# Altium schematic sheet FMC.SchDoc: FMC 5GS/s ADC/TDC
size 420 x 297 mm; Author: Agnieszka Bartkowicz; CompanyName: WUT ISE; DrawnBy: Agnieszka Bartkowicz; Engineer: Agnieszka Bartkowicz; Organization: WUT ISE; Address1: PW ISE; Address2: Nowowiejska 15/19 00-665 Warsaw; Address3: gyorka@o2.pl; SheetNumber: 11; SheetTotal: 13; ModifiedBy: -; CheckedDate: -; Title2: Title 2; DivGrp: WUT ISE; Designer: A. Bartkowicz
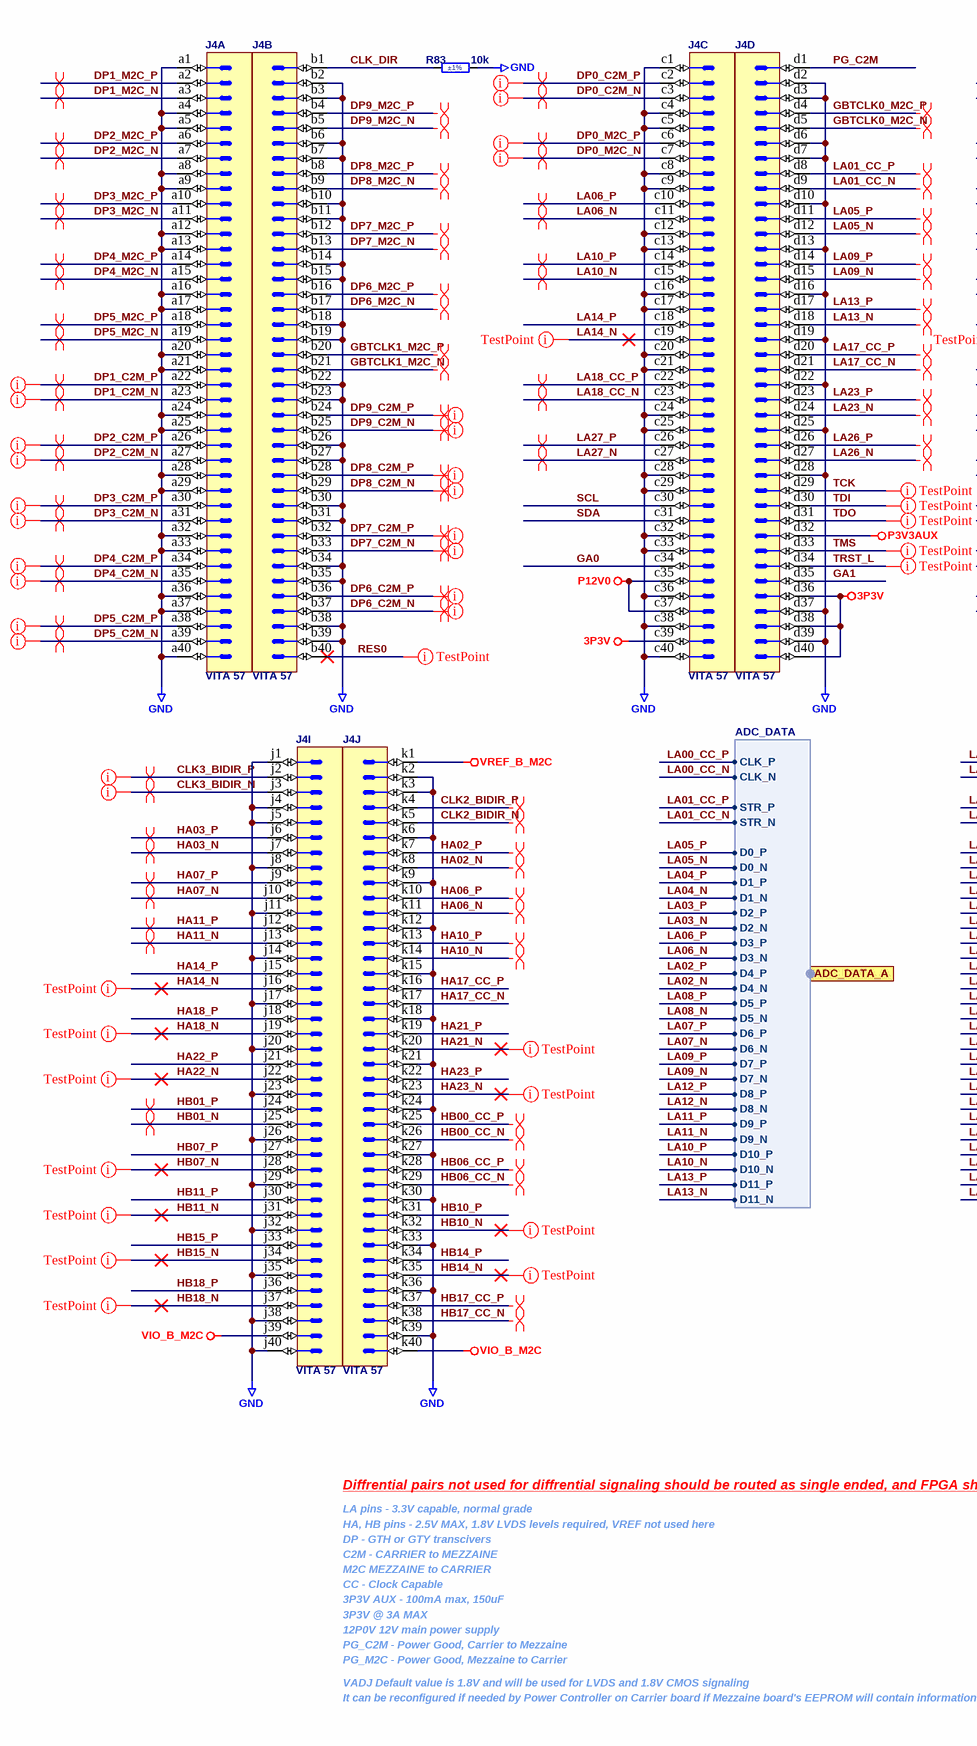
[diagram p0: FMC.SchDoc, left]
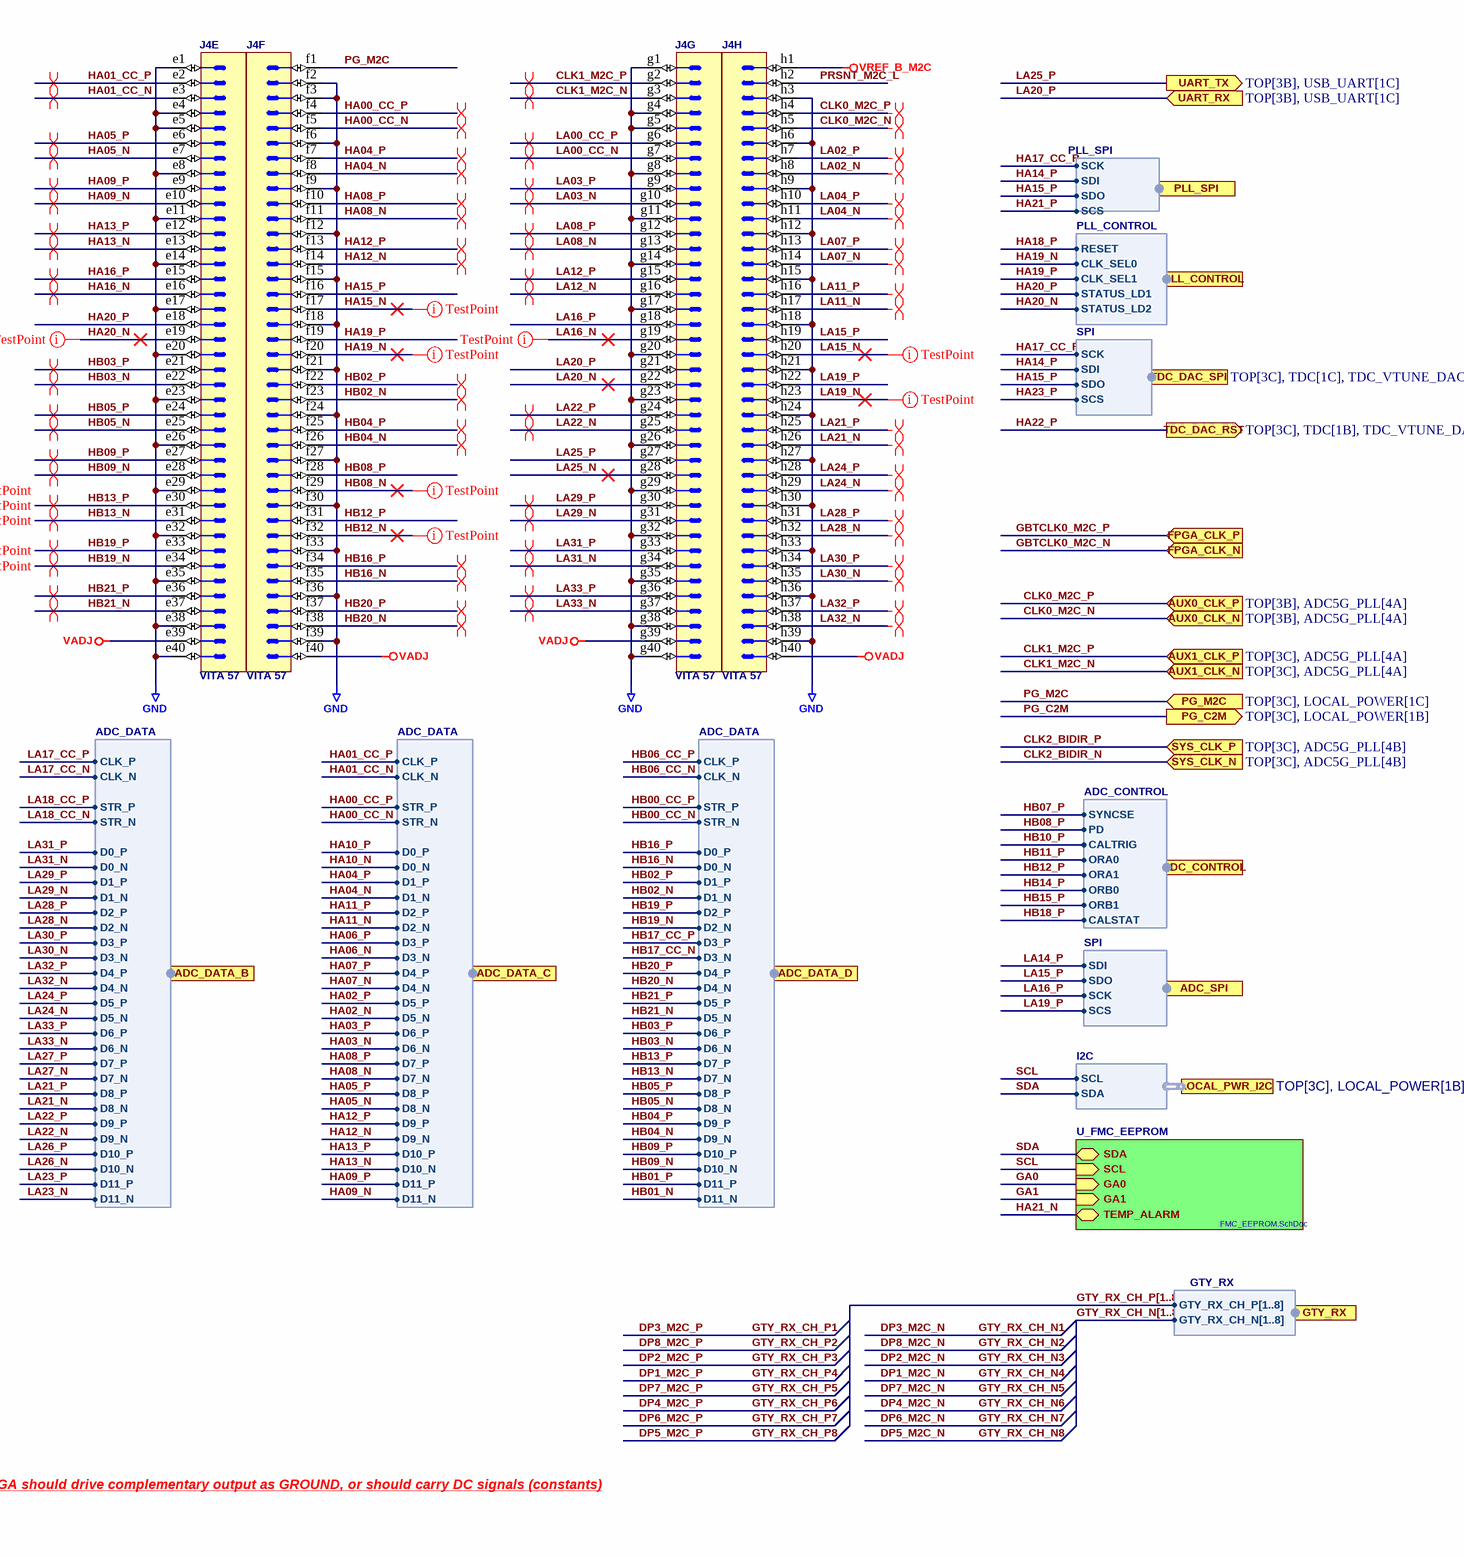
[diagram p1: FMC.SchDoc, right]

## Parts
J4  VITA 57  [SAMTEC_ASP-134488-01]  (parts A,B,C,D,E,F,G,H,I,J of 10)
R83  10k  Tolerance: ±1%  [RESC1005X40N]

## Sub-sheets
U_FMC_EEPROM = FMC_EEPROM.SchDoc: SDA (bidir), SCL (in), GA0 (in), GA1 (in), TEMP_ALARM (bidir)

## Ports
ADC_CONTROL (in, harness ADC_CONTROL, see TOP[3B], ADC5G[4B], ADC5G_FRONTEND[2C]), ADC_DATA_A (in, harness ADC_DATA, see TOP[3B], ADC5G[4B], ADC5G_DIGITALIO[3B]), ADC_DATA_B (in, harness ADC_DATA, see TOP[3B], ADC5G[4B], ADC5G_DIGITALIO[3D]), ADC_DATA_C (in, harness ADC_DATA, see TOP[3B], ADC5G[4B], ADC5G_DIGITALIO[4B]), ADC_DATA_D (in, harness ADC_DATA, see TOP[3B], ADC5G[4B], ADC5G_DIGITALIO[4D]), ADC_SPI (in, harness SPI, see TOP[3B], ADC5G[4B], ADC5G_FRONTEND[2C]), AUX0_CLK_N (in, see TOP[3B], ADC5G_PLL[4A]), AUX0_CLK_P (in, see TOP[3B], ADC5G_PLL[4A]), AUX1_CLK_N (in, see TOP[3C], ADC5G_PLL[4A]), AUX1_CLK_P (in, see TOP[3C], ADC5G_PLL[4A]), FPGA_CLK_N (in, see TOP[3B], ADC5G_PLL[4B]), FPGA_CLK_P (in, see TOP[3B], ADC5G_PLL[4B]), GTY_RX (in, harness GTY_RX, see TOP[3C], TDC[5A]), LOCAL_PWR_I2C (harness I2C, see TOP[3C], LOCAL_POWER[1B]), PG_C2M (out, see TOP[3C], LOCAL_POWER[1B]), PG_M2C (in, see TOP[3C], LOCAL_POWER[1C]), PLL_CONTROL (in, harness PLL_CONTROL, see TOP[3B], ADC5G_PLL[5D]), PLL_SPI (in, harness PLL_SPI, see TOP[3B], ADC5G_PLL[5C]), SYS_CLK_N (in, see TOP[3C], ADC5G_PLL[4B]), SYS_CLK_P (in, see TOP[3C], ADC5G_PLL[4B]), TDC_DAC_RST (out, see TOP[3C], TDC[1B], TDC_VTUNE_DAC[2B]), TDC_DAC_SPI (in, harness SPI, see TOP[3C], TDC[1C], TDC_VTUNE_DAC[2A]), UART_RX (in, see TOP[3B], USB_UART[1C]), UART_TX (out, see TOP[3B], USB_UART[1C])

## Harnesses
ADC_DATA: CLK_P, CLK_N, STR_P, STR_N, D0_P, D1_P, D2_P, D3_P, D4_P, D5_P, D6_P, D7_P, D8_P, D9_P, D10_P, D11_P, D11_N, D10_N, D9_N, D8_N, D7_N, D6_N, D5_N, D4_N, D3_N, D2_N, D1_N, D0_N
SPI: SDI, SDO, SCK, SCS
ADC_CONTROL: SYNCSE, PD, CALTRIG, ORA0, ORA1, ORB0, ORB1, CALSTAT
PLL_SPI: SCK, SDI, SDO, SCS
PLL_CONTROL: RESET, CLK_SEL0, CLK_SEL1, STATUS_LD1, STATUS_LD2
GTY_RX: GTY_RX_CH_P[1..8], GTY_RX_CH_N[1..8]
I2C: SCL, SDA

## Nets
3P3V: J4.c39 J4.d36 J4.d38 J4.d40
GND: J4.a1 J4.a4 J4.a5 J4.a8 J4.a9 J4.a12 J4.a13 J4.a16 J4.a17 J4.a20 J4.a21 J4.a24 J4.a25 J4.a28 J4.a29 J4.a32 J4.a33 J4.a36 J4.a37 J4.a40 J4.b2 J4.b3 J4.b6 J4.b7 J4.b10 J4.b11 J4.b14 J4.b15 J4.b18 J4.b19 J4.b22 J4.b23 J4.b26 J4.b27 J4.b30 J4.b31 J4.b34 J4.b35 J4.b38 J4.b39 J4.c1 J4.c4 J4.c5 J4.c8 J4.c9 J4.c12 J4.c13 J4.c16 J4.c17 J4.c20 J4.c21 J4.c24 J4.c25 J4.c28 J4.c29 J4.c32 J4.c33 J4.c36 J4.c38 J4.c40 J4.d2 J4.d3 J4.d6 J4.d7 J4.d10 J4.d13 J4.d16 J4.d19 J4.d22 J4.d25 J4.d28 J4.d37 J4.d39 J4.e1 J4.e4 J4.e5 J4.e8 J4.e11 J4.e14 J4.e17 J4.e20 J4.e23 J4.e26 J4.e29 J4.e32 J4.e35 J4.e38 J4.e40 J4.f2 J4.f3 J4.f6 J4.f9 J4.f12 J4.f15 J4.f18 J4.f21 J4.f24 J4.f27 J4.f30 J4.f33 J4.f36 J4.f39 J4.g1 J4.g4 J4.g5 J4.g8 J4.g11 J4.g14 J4.g17 J4.g20 J4.g23 J4.g26 J4.g29 J4.g32 J4.g35 J4.g38 J4.g40 J4.h3 J4.h6 J4.h9 J4.h12 J4.h15 J4.h18 J4.h21 J4.h24 J4.h27 J4.h30 J4.h33 J4.h36 J4.h39 J4.j1 J4.j4 J4.j5 J4.j8 J4.j11 J4.j14 J4.j17 J4.j20 J4.j23 J4.j26 J4.j29 J4.j32 J4.j35 J4.j38 J4.j40 J4.k2 J4.k3 J4.k6 J4.k9 J4.k12 J4.k15 J4.k18 J4.k21 J4.k24 J4.k27 J4.k30 J4.k33 J4.k36 J4.k39 R83.2
P3V3AUX: J4.d32
P12V0: J4.c35 J4.c37
VADJ: J4.e39 J4.f40 J4.g39 J4.h40
VIO_B_M2C: J4.j39 J4.k40
VREF_B_M2C: J4.h1 J4.k1
CLK0_M2C_N: J4.h5 ; port AUX0_CLK_N
CLK0_M2C_P: J4.h4 ; port AUX0_CLK_P
CLK1_M2C_N: J4.g3 ; port AUX1_CLK_N
CLK1_M2C_P: J4.g2 ; port AUX1_CLK_P
CLK2_BIDIR_N: J4.k5 ; port SYS_CLK_N
CLK2_BIDIR_P: J4.k4 ; port SYS_CLK_P
CLK3_BIDIR_N: J4.j3
CLK3_BIDIR_P: J4.j2
CLK_DIR: J4.b1 R83.1
DP0_C2M_N: J4.c3
DP0_C2M_P: J4.c2
DP0_M2C_N: J4.c7
DP0_M2C_P: J4.c6
DP1_C2M_N: J4.a23
DP1_C2M_P: J4.a22
DP1_M2C_N: J4.a3  [also labelled GTY_RX_CH_N4]
DP1_M2C_P: J4.a2  [also labelled GTY_RX_CH_P4]
DP2_C2M_N: J4.a27
DP2_C2M_P: J4.a26
DP2_M2C_N: J4.a7  [also labelled GTY_RX_CH_N3]
DP2_M2C_P: J4.a6  [also labelled GTY_RX_CH_P3]
DP3_C2M_N: J4.a31
DP3_C2M_P: J4.a30
DP3_M2C_N: J4.a11  [also labelled GTY_RX_CH_N1]
DP3_M2C_P: J4.a10  [also labelled GTY_RX_CH_P1]
DP4_C2M_N: J4.a35
DP4_C2M_P: J4.a34
DP4_M2C_N: J4.a15  [also labelled GTY_RX_CH_N6]
DP4_M2C_P: J4.a14  [also labelled GTY_RX_CH_P6]
DP5_C2M_N: J4.a39
DP5_C2M_P: J4.a38
DP5_M2C_N: J4.a19  [also labelled GTY_RX_CH_N8]
DP5_M2C_P: J4.a18  [also labelled GTY_RX_CH_P8]
DP6_C2M_N: J4.b37
DP6_C2M_P: J4.b36
DP6_M2C_N: J4.b17  [also labelled GTY_RX_CH_N7]
DP6_M2C_P: J4.b16  [also labelled GTY_RX_CH_P7]
DP7_C2M_N: J4.b33
DP7_C2M_P: J4.b32
DP7_M2C_N: J4.b13  [also labelled GTY_RX_CH_N5]
DP7_M2C_P: J4.b12  [also labelled GTY_RX_CH_P5]
DP8_C2M_N: J4.b29
DP8_C2M_P: J4.b28
DP8_M2C_N: J4.b9  [also labelled GTY_RX_CH_N2]
DP8_M2C_P: J4.b8  [also labelled GTY_RX_CH_P2]
DP9_C2M_N: J4.b25
DP9_C2M_P: J4.b24
DP9_M2C_N: J4.b5
DP9_M2C_P: J4.b4
GA0: J4.c34 ; sheet U_FMC_EEPROM/GA0
GA1: J4.d35 ; sheet U_FMC_EEPROM/GA1
GBTCLK0_M2C_N: J4.d5 ; port FPGA_CLK_N
GBTCLK0_M2C_P: J4.d4 ; port FPGA_CLK_P
GBTCLK1_M2C_N: J4.b21
GBTCLK1_M2C_P: J4.b20
HA00_CC_N: J4.f5 ; port ADC_DATA_C.STR_N
HA00_CC_P: J4.f4 ; port ADC_DATA_C.STR_P
HA01_CC_N: J4.e3 ; port ADC_DATA_C.CLK_N
HA01_CC_P: J4.e2 ; port ADC_DATA_C.CLK_P
HA02_N: J4.k8 ; port ADC_DATA_C.D5_N
HA02_P: J4.k7 ; port ADC_DATA_C.D5_P
HA03_N: J4.j7 ; port ADC_DATA_C.D6_N
HA03_P: J4.j6 ; port ADC_DATA_C.D6_P
HA04_N: J4.f8 ; port ADC_DATA_C.D1_N
HA04_P: J4.f7 ; port ADC_DATA_C.D1_P
HA05_N: J4.e7 ; port ADC_DATA_C.D8_N
HA05_P: J4.e6 ; port ADC_DATA_C.D8_P
HA06_N: J4.k11 ; port ADC_DATA_C.D3_N
HA06_P: J4.k10 ; port ADC_DATA_C.D3_P
HA07_N: J4.j10 ; port ADC_DATA_C.D4_N
HA07_P: J4.j9 ; port ADC_DATA_C.D4_P
HA08_N: J4.f11 ; port ADC_DATA_C.D7_N
HA08_P: J4.f10 ; port ADC_DATA_C.D7_P
HA09_N: J4.e10 ; port ADC_DATA_C.D11_N
HA09_P: J4.e9 ; port ADC_DATA_C.D11_P
HA10_N: J4.k14 ; port ADC_DATA_C.D0_N
HA10_P: J4.k13 ; port ADC_DATA_C.D0_P
HA11_N: J4.j13 ; port ADC_DATA_C.D2_N
HA11_P: J4.j12 ; port ADC_DATA_C.D2_P
HA12_N: J4.f14 ; port ADC_DATA_C.D9_N
HA12_P: J4.f13 ; port ADC_DATA_C.D9_P
HA13_N: J4.e13 ; port ADC_DATA_C.D10_N
HA13_P: J4.e12 ; port ADC_DATA_C.D10_P
HA14_N: J4.j16
HA14_P: J4.j15 ; port PLL_SPI.SDI, port TDC_DAC_SPI.SDI
HA15_N: J4.f17
HA15_P: J4.f16 ; port PLL_SPI.SDO, port TDC_DAC_SPI.SDO
HA16_N: J4.e16
HA16_P: J4.e15
HA17_CC_N: J4.k17
HA17_CC_P: J4.k16 ; port PLL_SPI.SCK, port TDC_DAC_SPI.SCK
HA18_N: J4.j19
HA18_P: J4.j18 ; port PLL_CONTROL.RESET
HA19_N: J4.f20 ; port PLL_CONTROL.CLK_SEL0
HA19_P: J4.f19 ; port PLL_CONTROL.CLK_SEL1
HA20_N: J4.e19 ; port PLL_CONTROL.STATUS_LD2
HA20_P: J4.e18 ; port PLL_CONTROL.STATUS_LD1
HA21_N: J4.k20 ; sheet U_FMC_EEPROM/TEMP_ALARM
HA21_P: J4.k19 ; port PLL_SPI.SCS
HA22_N: J4.j22
HA22_P: J4.j21 ; port TDC_DAC_RST
HA23_N: J4.k23
HA23_P: J4.k22 ; port TDC_DAC_SPI.SCS
HB00_CC_N: J4.k26 ; port ADC_DATA_D.STR_N
HB00_CC_P: J4.k25 ; port ADC_DATA_D.STR_P
HB01_N: J4.j25 ; port ADC_DATA_D.D11_N
HB01_P: J4.j24 ; port ADC_DATA_D.D11_P
HB02_N: J4.f23 ; port ADC_DATA_D.D1_N
HB02_P: J4.f22 ; port ADC_DATA_D.D1_P
HB03_N: J4.e22 ; port ADC_DATA_D.D6_N
HB03_P: J4.e21 ; port ADC_DATA_D.D6_P
HB04_N: J4.f26 ; port ADC_DATA_D.D9_N
HB04_P: J4.f25 ; port ADC_DATA_D.D9_P
HB05_N: J4.e25 ; port ADC_DATA_D.D8_N
HB05_P: J4.e24 ; port ADC_DATA_D.D8_P
HB06_CC_N: J4.k29 ; port ADC_DATA_D.CLK_N
HB06_CC_P: J4.k28 ; port ADC_DATA_D.CLK_P
HB07_N: J4.j28
HB07_P: J4.j27 ; port ADC_CONTROL.SYNCSE
HB08_N: J4.f29
HB08_P: J4.f28 ; port ADC_CONTROL.PD
HB09_N: J4.e28 ; port ADC_DATA_D.D10_N
HB09_P: J4.e27 ; port ADC_DATA_D.D10_P
HB10_N: J4.k32
HB10_P: J4.k31 ; port ADC_CONTROL.CALTRIG
HB11_N: J4.j31
HB11_P: J4.j30 ; port ADC_CONTROL.ORA0
HB12_N: J4.f32
HB12_P: J4.f31 ; port ADC_CONTROL.ORA1
HB13_N: J4.e31 ; port ADC_DATA_D.D7_N
HB13_P: J4.e30 ; port ADC_DATA_D.D7_P
HB14_N: J4.k35
HB14_P: J4.k34 ; port ADC_CONTROL.ORB0
HB15_N: J4.j34
HB15_P: J4.j33 ; port ADC_CONTROL.ORB1
HB16_N: J4.f35 ; port ADC_DATA_D.D0_N
HB16_P: J4.f34 ; port ADC_DATA_D.D0_P
HB17_CC_N: J4.k38 ; port ADC_DATA_D.D3_N
HB17_CC_P: J4.k37 ; port ADC_DATA_D.D3_P
HB18_N: J4.j37
HB18_P: J4.j36 ; port ADC_CONTROL.CALSTAT
HB19_N: J4.e34 ; port ADC_DATA_D.D2_N
HB19_P: J4.e33 ; port ADC_DATA_D.D2_P
HB20_N: J4.f38 ; port ADC_DATA_D.D4_N
HB20_P: J4.f37 ; port ADC_DATA_D.D4_P
HB21_N: J4.e37 ; port ADC_DATA_D.D5_N
HB21_P: J4.e36 ; port ADC_DATA_D.D5_P
LA00_CC_N: J4.g7 ; port ADC_DATA_A.CLK_N
LA00_CC_P: J4.g6 ; port ADC_DATA_A.CLK_P
LA01_CC_N: J4.d9 ; port ADC_DATA_A.STR_N
LA01_CC_P: J4.d8 ; port ADC_DATA_A.STR_P
LA02_N: J4.h8 ; port ADC_DATA_A.D4_N
LA02_P: J4.h7 ; port ADC_DATA_A.D4_P
LA03_N: J4.g10 ; port ADC_DATA_A.D2_N
LA03_P: J4.g9 ; port ADC_DATA_A.D2_P
LA04_N: J4.h11 ; port ADC_DATA_A.D1_N
LA04_P: J4.h10 ; port ADC_DATA_A.D1_P
LA05_N: J4.d12 ; port ADC_DATA_A.D0_N
LA05_P: J4.d11 ; port ADC_DATA_A.D0_P
LA06_N: J4.c11 ; port ADC_DATA_A.D3_N
LA06_P: J4.c10 ; port ADC_DATA_A.D3_P
LA07_N: J4.h14 ; port ADC_DATA_A.D6_N
LA07_P: J4.h13 ; port ADC_DATA_A.D6_P
LA08_N: J4.g13 ; port ADC_DATA_A.D5_N
LA08_P: J4.g12 ; port ADC_DATA_A.D5_P
LA09_N: J4.d15 ; port ADC_DATA_A.D7_N
LA09_P: J4.d14 ; port ADC_DATA_A.D7_P
LA10_N: J4.c15 ; port ADC_DATA_A.D10_N
LA10_P: J4.c14 ; port ADC_DATA_A.D10_P
LA11_N: J4.h17 ; port ADC_DATA_A.D9_N
LA11_P: J4.h16 ; port ADC_DATA_A.D9_P
LA12_N: J4.g16 ; port ADC_DATA_A.D8_N
LA12_P: J4.g15 ; port ADC_DATA_A.D8_P
LA13_N: J4.d18 ; port ADC_DATA_A.D11_N
LA13_P: J4.d17 ; port ADC_DATA_A.D11_P
LA14_N: J4.c19
LA14_P: J4.c18 ; port ADC_SPI.SDI
LA15_N: J4.h20
LA15_P: J4.h19 ; port ADC_SPI.SDO
LA16_N: J4.g19
LA16_P: J4.g18 ; port ADC_SPI.SCK
LA17_CC_N: J4.d21 ; port ADC_DATA_B.CLK_N
LA17_CC_P: J4.d20 ; port ADC_DATA_B.CLK_P
LA18_CC_N: J4.c23 ; port ADC_DATA_B.STR_N
LA18_CC_P: J4.c22 ; port ADC_DATA_B.STR_P
LA19_N: J4.h23
LA19_P: J4.h22 ; port ADC_SPI.SCS
LA20_N: J4.g22
LA20_P: J4.g21 ; port UART_RX
LA21_N: J4.h26 ; port ADC_DATA_B.D8_N
LA21_P: J4.h25 ; port ADC_DATA_B.D8_P
LA22_N: J4.g25 ; port ADC_DATA_B.D9_N
LA22_P: J4.g24 ; port ADC_DATA_B.D9_P
LA23_N: J4.d24 ; port ADC_DATA_B.D11_N
LA23_P: J4.d23 ; port ADC_DATA_B.D11_P
LA24_N: J4.h29 ; port ADC_DATA_B.D5_N
LA24_P: J4.h28 ; port ADC_DATA_B.D5_P
LA25_N: J4.g28
LA25_P: J4.g27 ; port UART_TX
LA26_N: J4.d27 ; port ADC_DATA_B.D10_N
LA26_P: J4.d26 ; port ADC_DATA_B.D10_P
LA27_N: J4.c27 ; port ADC_DATA_B.D7_N
LA27_P: J4.c26 ; port ADC_DATA_B.D7_P
LA28_N: J4.h32 ; port ADC_DATA_B.D2_N
LA28_P: J4.h31 ; port ADC_DATA_B.D2_P
LA29_N: J4.g31 ; port ADC_DATA_B.D1_N
LA29_P: J4.g30 ; port ADC_DATA_B.D1_P
LA30_N: J4.h35 ; port ADC_DATA_B.D3_N
LA30_P: J4.h34 ; port ADC_DATA_B.D3_P
LA31_N: J4.g34 ; port ADC_DATA_B.D0_N
LA31_P: J4.g33 ; port ADC_DATA_B.D0_P
LA32_N: J4.h38 ; port ADC_DATA_B.D4_N
LA32_P: J4.h37 ; port ADC_DATA_B.D4_P
LA33_N: J4.g37 ; port ADC_DATA_B.D6_N
LA33_P: J4.g36 ; port ADC_DATA_B.D6_P
PG_C2M: J4.d1 ; port PG_C2M
PG_M2C: J4.f1 ; port PG_M2C
PRSNT_M2C_L: J4.h2
RES0: J4.b40
SCL: J4.c30 ; sheet U_FMC_EEPROM/SCL, port LOCAL_PWR_I2C.SCL
SDA: J4.c31 ; sheet U_FMC_EEPROM/SDA, port LOCAL_PWR_I2C.SDA
TCK: J4.d29
TDI: J4.d30
TDO: J4.d31
TMS: J4.d33
TRST_L: J4.d34

## Buses and harness runs
bus GTY_RX_CH_N[1..8]
bus GTY_RX_CH_P[1..8]

## Layout directives
differential pair: CLK0_M2C_N, CLK0_M2C_P, CLK1_M2C_N, CLK1_M2C_P, CLK2_BIDIR_N, CLK2_BIDIR_P, CLK3_BIDIR_N, CLK3_BIDIR_P, DP0_C2M_N, DP0_C2M_P, DP0_M2C_N, DP0_M2C_P, DP1_C2M_N, DP1_C2M_P, DP1_M2C_N, DP1_M2C_P, DP2_C2M_N, DP2_C2M_P, DP2_M2C_N, DP2_M2C_P, DP3_C2M_N, DP3_C2M_P, DP3_M2C_N, DP3_M2C_P, DP4_C2M_N, DP4_C2M_P, DP4_M2C_N, DP4_M2C_P, DP5_C2M_N, DP5_C2M_P, DP5_M2C_N, DP5_M2C_P, DP6_C2M_N, DP6_C2M_P, DP6_M2C_N, DP6_M2C_P, DP7_C2M_N, DP7_C2M_P, DP7_M2C_N, DP7_M2C_P, DP8_C2M_N, DP8_C2M_P, DP8_M2C_N, DP8_M2C_P, DP9_C2M_N, DP9_C2M_P, DP9_M2C_N, DP9_M2C_P, GBTCLK0_M2C_N, GBTCLK0_M2C_P, GBTCLK1_M2C_N, GBTCLK1_M2C_P, HA00_CC_N, HA00_CC_P, HA01_CC_N, HA01_CC_P, HA02_N, HA02_P, HA03_N, HA03_P, HA04_N, HA04_P, HA05_N, HA05_P, HA06_N, HA06_P, HA07_N, HA07_P, HA08_N, HA08_P, HA09_N, HA09_P, HA10_N, HA10_P, HA11_N, HA11_P, HA12_N, HA12_P, HA13_N, HA13_P, HA16_N, HA16_P, HB00_CC_N, HB00_CC_P, HB01_N, HB01_P, HB02_N, HB02_P, HB03_N, HB03_P, HB04_N, HB04_P, HB05_N, HB05_P, HB06_CC_N, HB06_CC_P, HB09_N, HB09_P, HB13_N, HB13_P, HB16_N, HB16_P, HB17_CC_N, HB17_CC_P, HB19_N, HB19_P, HB20_N, HB20_P, HB21_N, HB21_P, LA00_CC_N, LA00_CC_P, LA01_CC_N, LA01_CC_P, LA02_N, LA02_P, LA03_N, LA03_P, LA04_N, LA04_P, LA05_N, LA05_P, LA06_N, LA06_P, LA07_N, LA07_P, LA08_N, LA08_P, LA09_N, LA09_P, LA10_N, LA10_P, LA11_N, LA11_P, LA12_N, LA12_P, LA13_N, LA13_P, LA17_CC_N, LA17_CC_P, LA18_CC_N, LA18_CC_P, LA21_N, LA21_P, LA22_N, LA22_P, LA23_N, LA23_P, LA24_N, LA24_P, LA26_N, LA26_P, LA27_N, LA27_P, LA28_N, LA28_P, LA29_N, LA29_P, LA30_N, LA30_P, LA31_N, LA31_P, LA32_N, LA32_P, LA33_N, LA33_P
net class Test_Point: CLK3_BIDIR_N, CLK3_BIDIR_P, DP0_C2M_N, DP0_C2M_P, DP0_M2C_N, DP0_M2C_P, DP1_C2M_N, DP1_C2M_P, DP2_C2M_N, DP2_C2M_P, DP3_C2M_N, DP3_C2M_P, DP4_C2M_N, DP4_C2M_P, DP5_C2M_N, DP5_C2M_P, DP6_C2M_N, DP6_C2M_P, DP7_C2M_N, DP7_C2M_P, DP8_C2M_N, DP8_C2M_P, DP9_C2M_N, DP9_C2M_P, HA14_N, HA15_N, HA18_N, HA19_N, HA20_N, HA21_N, HA22_N, HA23_N, HB07_N, HB08_N, HB10_N, HB11_N, HB12_N, HB14_N, HB15_N, HB18_N, LA14_N, LA15_N, LA16_N, LA19_N, RES0, TCK, TDI, TDO, TMS, TRST_L

## Notes on the sheet
- LA pins - 3.3V capable, normal grade
- HA, HB pins - 2.5V MAX, 1.8V LVDS levels required, VREF not used here
- DP - GTH or GTY transcivers
- Diffrential pairs not used for diffrential signaling should be routed as single ended, and FPGA should drive complementary output as GROUND, or should carry DC signals (constants)
- C2M - CARRIER to MEZZAINE
- M2C MEZZAINE to CARRIER
- CC - Clock Capable
- 3P3V AUX - 100mA max, 150uF
- 3P3V @ 3A MAX
- 12P0V 12V main power supply
- PG_C2M - Power Good, Carrier to Mezzaine
- PG_M2C - Power Good, Mezzaine to Carrier
- VADJ Default value is 1.8V and will be used for LVDS and 1.8V CMOS signaling
- It can be reconfigured if needed by Power Controller on Carrier board if Mezzaine board's EEPROM will contain information to do so
- Project/Equipment
- Document
- Designer
- Drawn by
- Check.by
- Copyright WUT ISE 2024.
  This documentation describes Open Hardware and is licensed under the CERN OHL v.2. You may redistribute and modify this documentation under the terms of the CERN OHL v.2. (http://ohwr.org/CERNOHL). This documentation is distributed WITHOUT ANY EXPRESS OR IMPLIED WARRANTY, INCLUDING OF MERCHANTABILITY, SATISFACTORY QUALITY AND FITNESS FOR A PARTICULAR PURPOSE. Please see the CERN OHL v.2 for applicable conditions.
- Contact
- File
- Last Mod.
- Print Date
- Sheet
- Size
- A3
- of
- Rev

## Library data of the parts
J4 = SAMTEC_ASP-134488-01: Connector VITA 57, 400 Male contacts in 10 row abcdefghj; Part Description: 400 contacts (10 rows abcdefghjk) Surface Mount Male Connector, VITA 57 (MC-HPC-10); Manufacturer: SAMTEC; PressFit: No; Sense Comment: Solder Paste Deposition Sensitive – Check Manufacturer Recommendations for Stencil Design; Part Number: SAMTEC_ASP-134488-01; Component Kind: Standard; Component Type: Standard; Pin Count: 400; Family: VITA 57; Mounted: Yes; Socket: No; SMD: Yes; Sense: Yes; Status: None; Manufacturer Part Number: ASP-134488-01; ComponentHeight: 6.1mm; HelpURL: \\cern.ch\dfs\Applications\Altium\Datasheets\SAMTEC_ASP-134488-01.pdf; Author: CERN DEM JLC; CreateDate: 30.04.2009; LatestRevisionDate: 10.02.2022
R83 = R0402_10K_1%_0.0625W_100PPM: Resistor - 1%; Part Description: General Purpose Thick Film Chip Resistor; Manufacturer: GENERIC; Manufacturer1 Part Number: 232270671003L; TC: ±100ppm/°C; PressFit: No; Part Number: R0402_10K_1%_0.0625W_100PPM; Component Kind: Standard; Component Type: Standard; Pin Count: 2; Value: 10k; Status: Not Recommended; Power: 0.0625W; Manufacturer Part Number: R0402_10K_1%_0.0625W_100PPM; Case: 0402; Mounted: Yes; Sense: No; Socket: No; SMD: Yes; Manufacturer1 Example: YAGEO PHYCOMP; Manufacturer1 ComponentHeight: 0.4mm; HelpURL: \\cern.ch\dfs\Applications\Altium\Datasheets\R0402_Phycomp_RC0402.pdf; Author: CERN DEM JLC; CreateDate: 03.12.2007; LatestRevisionDate: 17.10.2012